# Altium schematic sheet RJ-50.SchDoc: RJ-50
size 420 x 297 mm; DocumentNumber: 5; SheetNumber: 5; SheetTotal: 8
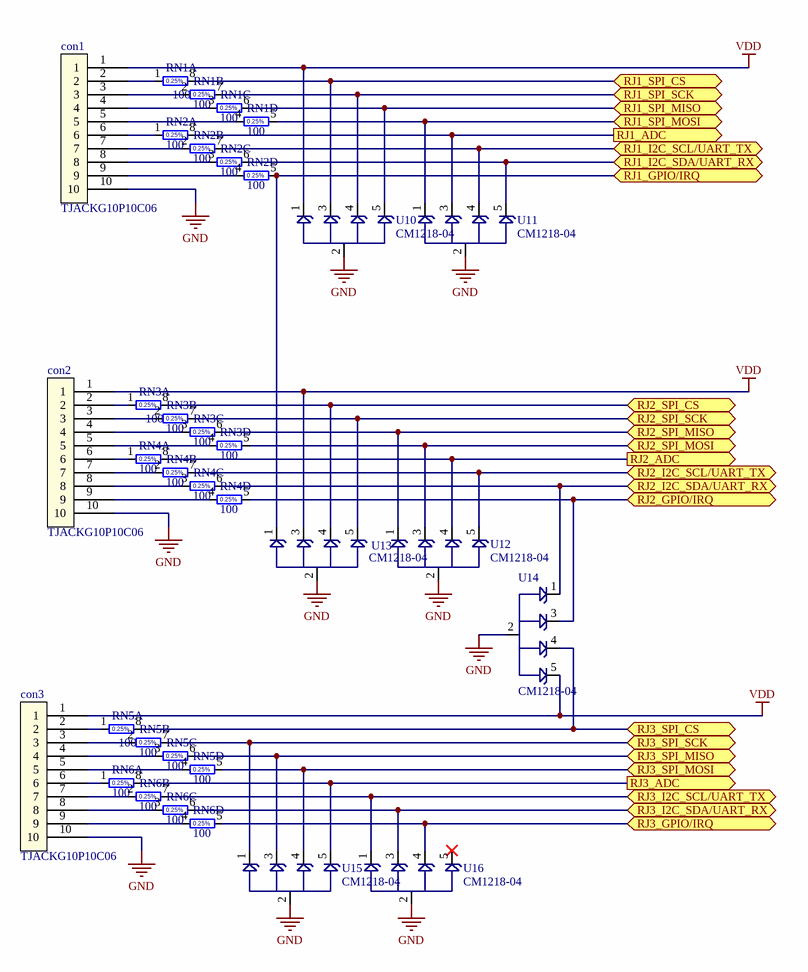
[diagram p0: RJ-50.SchDoc]

## Parts
con1  TJACKG10P10C06  [RJ-50 TJACKG10P10C06]
con2  TJACKG10P10C06  [RJ-50 TJACKG10P10C06]
con3  TJACKG10P10C06  [RJ-50 TJACKG10P10C06]
RN1  100  [RN_VISHAY_ACAS0612]  (parts A,B,C,D of 4)
RN2  100  [RN_VISHAY_ACAS0612]  (parts A,B,C,D of 4)
RN3  100  [RN_VISHAY_ACAS0612]  (parts A,B,C,D of 4)
RN4  100  [RN_VISHAY_ACAS0612]  (parts A,B,C,D of 4)
RN5  100  [RN_VISHAY_ACAS0612]  (parts A,B,C,D of 4)
RN6  100  [RN_VISHAY_ACAS0612]  (parts A,B,C,D of 4)
U10  CM1218-04  [ESD PROTECTOR]
U11  CM1218-04  [ESD PROTECTOR]
U12  CM1218-04  [ESD PROTECTOR]
U13  CM1218-04  [ESD PROTECTOR]
U14  CM1218-04  [ESD PROTECTOR]
U15  CM1218-04  [ESD PROTECTOR]
U16  CM1218-04  [ESD PROTECTOR]

## Ports
RJ1_ADC (out), RJ1_GPIO/IRQ (bidir), RJ1_I2C_SCL/UART_TX (bidir), RJ1_I2C_SDA/UART_RX (bidir), RJ1_SPI_CS (bidir), RJ1_SPI_MISO (bidir), RJ1_SPI_MOSI (bidir), RJ1_SPI_SCK (bidir), RJ2_ADC (out), RJ2_GPIO/IRQ (bidir), RJ2_I2C_SCL/UART_TX (bidir), RJ2_I2C_SDA/UART_RX (bidir), RJ2_SPI_CS (bidir), RJ2_SPI_MISO (bidir), RJ2_SPI_MOSI (bidir), RJ2_SPI_SCK (bidir), RJ3_ADC (out), RJ3_GPIO/IRQ (bidir), RJ3_I2C_SCL/UART_TX (bidir), RJ3_I2C_SDA/UART_RX (bidir), RJ3_SPI_CS (bidir), RJ3_SPI_MISO (bidir), RJ3_SPI_MOSI (bidir), RJ3_SPI_SCK (bidir)

## Nets
GND: con1.10 con2.10 con3.10 U10.2 U11.2 U12.2 U13.2 U14.2 U15.2 U16.2
VDD: con1.1 con2.1 con3.1 U10.1 U13.3 U14.5
RJ1_ADC: RN2.8 U11.3 ; port RJ1_ADC
RJ1_GPIO/IRQ: RN2.5 U13.1 ; port RJ1_GPIO/IRQ
RJ1_I2C_SCL/UART_TX: RN2.7 U11.4 ; port RJ1_I2C_SCL/UART_TX
RJ1_I2C_SDA/UART_RX: RN2.6 U11.5 ; port RJ1_I2C_SDA/UART_RX
RJ1_SPI_CS: RN1.8 U10.3 ; port RJ1_SPI_CS
RJ1_SPI_MISO: RN1.6 U10.5 ; port RJ1_SPI_MISO
RJ1_SPI_MOSI: RN1.5 U11.1 ; port RJ1_SPI_MOSI
RJ1_SPI_SCK: RN1.7 U10.4 ; port RJ1_SPI_SCK
RJ2_ADC: RN4.8 U12.4 ; port RJ2_ADC
RJ2_GPIO/IRQ: RN4.5 U14.3 ; port RJ2_GPIO/IRQ
RJ2_I2C_SCL/UART_TX: RN4.7 U12.5 ; port RJ2_I2C_SCL/UART_TX
RJ2_I2C_SDA/UART_RX: RN4.6 U14.1 ; port RJ2_I2C_SDA/UART_RX
RJ2_SPI_CS: RN3.8 U13.4 ; port RJ2_SPI_CS
RJ2_SPI_MISO: RN3.6 U12.1 ; port RJ2_SPI_MISO
RJ2_SPI_MOSI: RN3.5 U12.3 ; port RJ2_SPI_MOSI
RJ2_SPI_SCK: RN3.7 U13.5 ; port RJ2_SPI_SCK
RJ3_ADC: RN6.8 U15.5 ; port RJ3_ADC
RJ3_GPIO/IRQ: RN6.5 U16.4 ; port RJ3_GPIO/IRQ
RJ3_I2C_SCL/UART_TX: RN6.7 U16.1 ; port RJ3_I2C_SCL/UART_TX
RJ3_I2C_SDA/UART_RX: RN6.6 U16.3 ; port RJ3_I2C_SDA/UART_RX
RJ3_SPI_CS: RN5.8 U14.4 ; port RJ3_SPI_CS
RJ3_SPI_MISO: RN5.6 U15.3 ; port RJ3_SPI_MISO
RJ3_SPI_MOSI: RN5.5 U15.4 ; port RJ3_SPI_MOSI
RJ3_SPI_SCK: RN5.7 U15.1 ; port RJ3_SPI_SCK
Netcon1_2: con1.2 RN1.1
Netcon1_3: con1.3 RN1.2
Netcon1_4: con1.4 RN1.3
Netcon1_5: con1.5 RN1.4
Netcon1_6: con1.6 RN2.1
Netcon1_7: con1.7 RN2.2
Netcon1_8: con1.8 RN2.3
Netcon1_9: con1.9 RN2.4
Netcon2_2: con2.2 RN3.1
Netcon2_3: con2.3 RN3.2
Netcon2_4: con2.4 RN3.3
Netcon2_5: con2.5 RN3.4
Netcon2_6: con2.6 RN4.1
Netcon2_7: con2.7 RN4.2
Netcon2_8: con2.8 RN4.3
Netcon2_9: con2.9 RN4.4
Netcon3_2: con3.2 RN5.1
Netcon3_3: con3.3 RN5.2
Netcon3_4: con3.4 RN5.3
Netcon3_5: con3.5 RN5.4
Netcon3_6: con3.6 RN6.1
Netcon3_7: con3.7 RN6.2
Netcon3_8: con3.8 RN6.3
Netcon3_9: con3.9 RN6.4

Not connected (* = marked no-connect by the designer): U16 5*

## Notes on the sheet
- Project/Equipment
- Document
- Sensorbox
- Designer
- Drawn by
- Check.by
- Copyright Creotech Instruments SA 2014.
  This documentation describes Open Hardware and is licensed under the CERN OHL v.1.1. You may redistribute and modify this documentation under the terms of the CERN OHL v.1.1. (http://ohwr.org/CERNOHL). This documentation is distributed WITHOUT ANY EXPRESS OR IMPLIED WARRANTY, INCLUDING OF MERCHANTABILITY, SATISFACTORY QUALITY AND FITNESS FOR A PARTICULAR PURPOSE. Please see the CERN OHL v.1.1 for applicable conditions.
- CTI
- Creotech Instruments S.A.
- File
- Last Mod.
- Print Date
- Sheet
- Size
- A3
- of
- Rev
- (in symbol RN_100R_VISHAY_ACASA1000E1000P100, part A) 0.25%
- (in symbol RN_100R_VISHAY_ACASA1000E1000P100, part B) 0.25%
- (in symbol RN_100R_VISHAY_ACASA1000E1000P100, part C) 0.25%
- (in symbol RN_100R_VISHAY_ACASA1000E1000P100, part D) 0.25%

## Library data of the parts
con1-con3 = TJACKG10P10C06 (RJ50 - Female connector)
RN1-RN6 = RN_100R_VISHAY_ACASA1000E1000P100: DIL8 Resistor Network 4 Isolated Resistor 0.25%; Part Description: Chip Resistor Array , 4 Isolated Resistor (Convex Terminal), ACAS 0612 Serie; Manufacturer: VISHAY  BEYSCHLAG; Power: 0.1W; TC: ±25ppm/°C; Table: Resistor Networks SMD; Part Number: RN_100R_VISHAY_ACASA1000E1000P100; Component Kind: Standard; Component Type: Standard; Pin Count: 8; Value: 100; Tolerance: ±0.25%; Manufacturer Part Number: ACASA1000E1000P100; Case: 1206; Mounted: Yes; Socket: No; SMD: Yes; ComponentHeight: 0.55mm; HelpURL: \\cern.ch\dfs\Applications\Altium\Datasheets\RN_VISHAY_ACAS0612.pdf; Author: CERN DEM JLC; CreateDate: 2011-05-12; LatestRevisionDate: 2011-05-12
U10-U16 = CM1218-04 ESD_Protector